# Altium schematic sheet EE464Project.SchDoc
size B; SheetNumber: 1; SheetTotal: 1
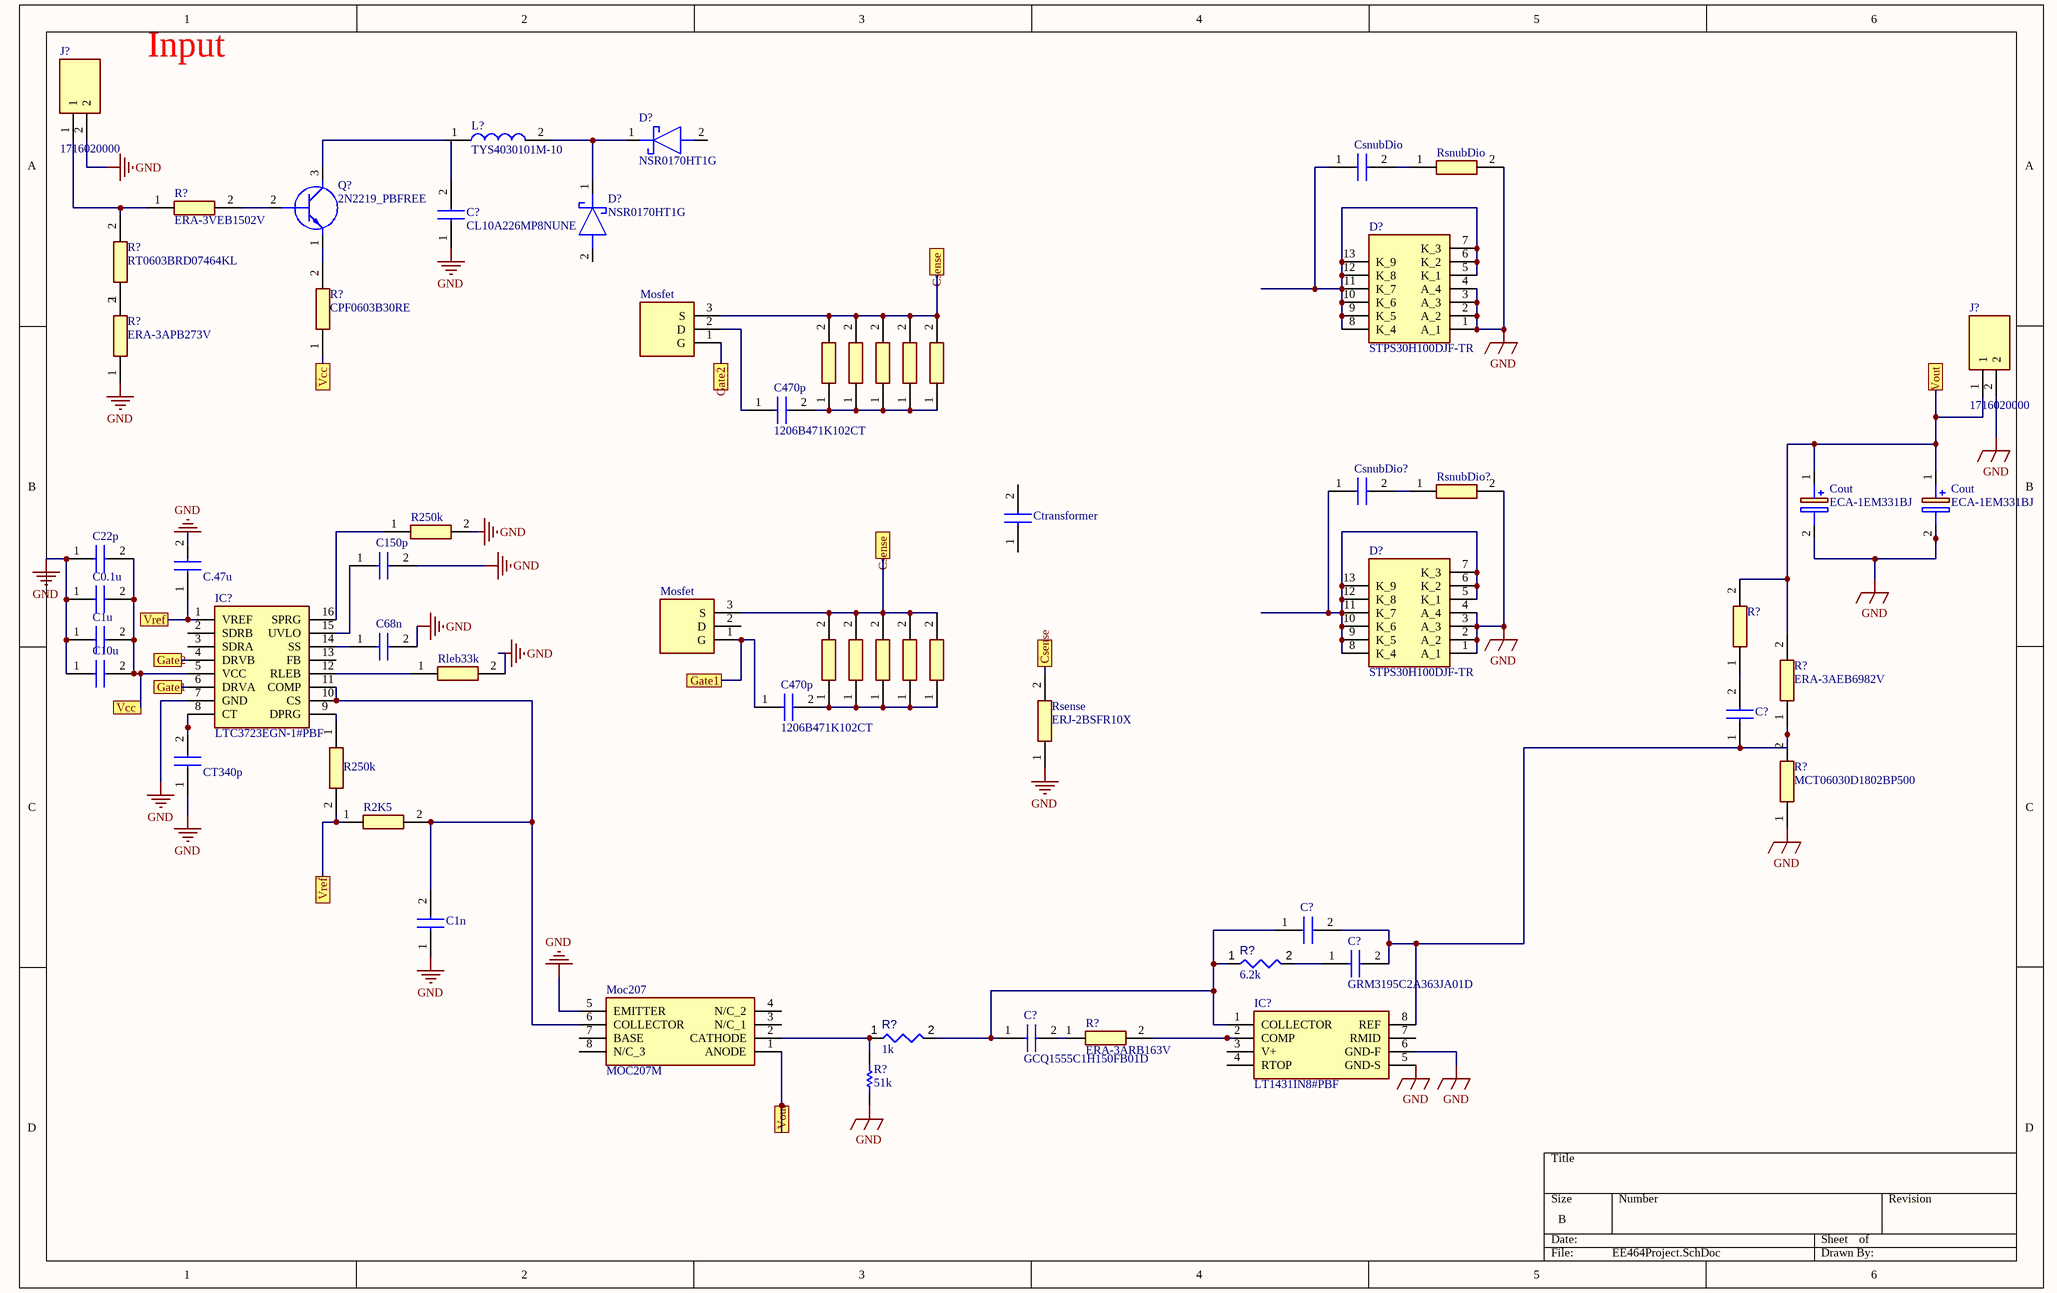
[diagram p0: EE464Project.SchDoc]

## Parts
(Parts that share a designator on the sheet are numbered #1, #2 ... from top to bottom, then left to right.)
C0.1u  06031C104K4Z2A  [CAPC1608X90N]  (value not drawn)
C1n  04025C102JAT2A  [CAPC1005X56N]  (value not drawn)
C1u  C1608X5R1H105K080AB  [CAPC1608X80N]  (value not drawn)
C10u  CL31A106MBHNNNE  [CAPC3216X180N]  (value not drawn)
C22p  06035A220JAT2A  [CAPC1608X90N]  (value not drawn)
C68n  885012206070  [CAPC1608X87N]  (value not drawn)
C150p  CL10C151JB8NNNC  [CAPC1608X90N]  (value not drawn)
C470p#1  1206B471K102CT  [CAPC3216X180N]
C470p#2  1206B471K102CT  [CAPC3216X180N]
C.47u  CGA4J1X8L1H474K125AE  [CAPC2012X145N]  (value not drawn)
C?#1  CL10A226MP8NUNE  [CAPC1608X105N]
C?#2  GRM21B5C2J222FWAAL  [CAPC2012X145N]  (value not drawn)
C?#3  C0402C121K8RACTU  [CAPC1005X55N]  (value not drawn)
C?#4  GRM3195C2A363JA01D  [CAPC3216X95N]
C?#5  GCQ1555C1H150FB01D  [CAPC1005X55N]
Cout#1  ECA-1EM331BJ  [CAPPRD350W65D825H1250]
Cout#2  ECA-1EM331BJ  [CAPPRD350W65D825H1250]
CsnubDio  GRM1885C2A201JA01D  [CAPC1608X90N]  (value not drawn)
CsnubDio?  GRM1885C2A201JA01D  [CAPC1608X90N]  (value not drawn)
CT340p  GRM1885C2A361JA01D  [CAPC1608X90N]  (value not drawn)
Ctransformer  C1210C104KBRACAUTO  [CAPC3225X280N]  (value not drawn)
D?#1  NSR0170HT1G  [SOD2512X100N]
D?#2  NSR0170HT1G  [SOD2512X100N]
D?#3  STPS30H100DJF-TR  [STPS30H100DJFTR]
D?#4  STPS30H100DJF-TR  [STPS30H100DJFTR]
IC?#1  LTC3723EGN-1#PBF  [SOP64P601X175-16N]
IC?#2  LT1431IN8#PBF  [DIP794W53P254L1016H394Q8N]
J?#1  1716020000  [1716020000]
J?#2  1716020000  [1716020000]
L?  TYS4030101M-10  [INDPM4040X300N]
Moc207  MOC207M  [SOIC127P594X363-8N]
Mosfet#1  STW11NK100Z  [TO545P515X1560X2445-3P]  (value not drawn)
Mosfet#2  STW11NK100Z  [TO545P515X1560X2445-3P]  (value not drawn)
Q?  2N2219_PBFREE  [2N3440PBFREE]
R2K5  ERA-3AED2491V  [ERA3AEB101V]  (value not drawn)
R250k#1  MCT06030C2493FP500  [RESC1608X55N]  (value not drawn)
R250k#2  MCT06030C2493FP500  [RESC1608X55N]  (value not drawn)
R?#1  ERA-3VEB1502V  [RESC1608X55N]
R?#2  RT0603BRD07464KL  [RESC1608X55N]
R?#3  CPF0603B30RE  [RESC1608X55N]
R?#4  ERA-3APB273V  [ERA3AEB101V]
R?#5  CPF0603B3K32E  [RESC1608X55N]  (value not drawn)
R?#6  ERA-3AEB6982V  [ERA3AEB101V]
R?#7  MCT06030D1802BP500  [RESC1608X55N]
R?#8  value 6.2k  [RESC0402(1005)_L]  (hidden comment: Resistor 6K2  +/-5 % 0402 63 mW)
R?#9  value 1k  [RESC0805(2012)_L]  (hidden comment: 1KR5J)
R?#10  ERA-3ARB163V  [ERA3AEB101V]
R?#11  value 51k  [RESC1005X40X25ML05T10]  (hidden comment: Resistor 51k +/-5% 0402 63 mW)
Rleb33k  ERA-3AED333V  [ERA3AEB101V]  (value not drawn)
Rsense  ERJ-2BSFR10X  [RESC1005X40N]
RsnubDio  RC0603FR-1022RL  [RESC1608X55N]  (value not drawn)
RsnubDio?  RC0603FR-1022RL  [RESC1608X55N]  (value not drawn)
Rsnubmos  CRGH2512F221R  [RESC6432X65N]  (value not drawn)
Rsnubmos?#1  CRGH2512F221R  [RESC6432X65N]  (value not drawn)
Rsnubmos?#2  CRGH2512F221R  [RESC6432X65N]  (value not drawn)
Rsnubmos?#3  CRGH2512F221R  [RESC6432X65N]  (value not drawn)
Rsnubmos?#4  CRGH2512F221R  [RESC6432X65N]  (value not drawn)
Rsnubmos?#5  CRGH2512F221R  [RESC6432X65N]  (value not drawn)
Rsnubmos?#6  CRGH2512F221R  [RESC6432X65N]  (value not drawn)
Rsnubmos?#7  CRGH2512F221R  [RESC6432X65N]  (value not drawn)
Rsnubmos?#8  CRGH2512F221R  [RESC6432X65N]  (value not drawn)
Rsnubmos?#9  CRGH2512F221R  [RESC6432X65N]  (value not drawn)

## Ports
Csense, Gate1, Gate2, Vcc, Vout, Vref

## Nets
GND: C0.1u.1 C1n.1 C1u.1 C10u.1 C22p.1 C68n.2 C150p.2 C.47u.2 C?#1.1 Cout#1.2(-) Cout#2.2(-) CT340p.1 D?#3.1(A_1) D?#3.2(A_2) D?#3.3(A_3) D?#3.4(A_4) D?#4.1(A_1) D?#4.2(A_2) D?#4.3(A_3) D?#4.4(A_4) IC?#1.7(GND) IC?#2.5(GND-S) IC?#2.6(GND-F) J?#1.2 J?#2.2 Moc207.5(EMITTER) R250k#1.2 R?#4.1 R?#7.1 R?#11.1 Rleb33k.2 Rsense.1 RsnubDio.2 RsnubDio?.2
Csense: Mosfet#1.3(S) Mosfet#2.3(S) Rsense.2 Rsnubmos.2 Rsnubmos?#1.2 Rsnubmos?#2.2 Rsnubmos?#3.2 Rsnubmos?#4.2 Rsnubmos?#5.2 Rsnubmos?#6.2 Rsnubmos?#7.2 Rsnubmos?#8.2 Rsnubmos?#9.2 ; port Csense
Gate1: C470p#2.1 IC?#1.6(DRVA) Mosfet#2.1(G) ; port Gate1
Gate2: IC?#1.4(DRVB) Mosfet#1.1(G) ; port Gate2
Vcc: C0.1u.2 C1u.2 C10u.2 C22p.2 IC?#1.5(VCC) R?#3.1 ; port Vcc
Vout: Cout#1.1(+) Cout#2.1(+) J?#2.1 Moc207.1(ANODE) R?#5.2 R?#6.2 ; port Vout
Vref: C.47u.1 IC?#1.1(VREF) R2K5.1 R250k#2.2 ; port Vref
NetC1n_2: C1n.2 IC?#1.10(CS) IC?#1.11(COMP) Moc207.6(COLLECTOR) R2K5.2
NetC68n_1: C68n.1 IC?#1.14(SS)
NetC150p_1: C150p.1 IC?#1.15(UVLO)
NetC470p#1_1: C470p#1.1 Mosfet#1.2(D)
NetC470p#1_2: C470p#1.2 Rsnubmos?#1.1 Rsnubmos?#2.1 Rsnubmos?#3.1 Rsnubmos?#4.1 Rsnubmos?#5.1
NetC470p#2_2: C470p#2.2 Rsnubmos.1 Rsnubmos?#6.1 Rsnubmos?#7.1 Rsnubmos?#8.1 Rsnubmos?#9.1
NetC?#2_1: C?#2.1 C?#3.2 C?#4.2 IC?#2.8(REF) R?#6.1 R?#7.2
NetC?#2_2: C?#2.2 R?#5.1
NetC?#3_1: C?#3.1 C?#5.1 IC?#2.1(COLLECTOR) R?#8.1 R?#9.2
NetC?#4_1: C?#4.1 R?#8.2
NetC?#5_2: C?#5.2 R?#10.1
NetCsnubDio?_1: CsnubDio?.1 D?#4.5(K_1) D?#4.6(K_2) D?#4.7(K_3) D?#4.8(K_4) D?#4.9(K_5) D?#4.10(K_6) D?#4.11(K_7) D?#4.12(K_8) D?#4.13(K_9)
NetCsnubDio?_2: CsnubDio?.2 RsnubDio?.1
NetCsnubDio_1: CsnubDio.1 D?#3.5(K_1) D?#3.6(K_2) D?#3.7(K_3) D?#3.8(K_4) D?#3.9(K_5) D?#3.10(K_6) D?#3.11(K_7) D?#3.12(K_8) D?#3.13(K_9)
NetCsnubDio_2: CsnubDio.2 RsnubDio.1
NetCT340p_2: CT340p.2 IC?#1.8(CT)
NetD?#1_1: D?#1.1(K) D?#2.1(K) L?.2
NetIC?#1_9: IC?#1.9(DPRG) R250k#2.1
NetIC?#1_12: IC?#1.12(RLEB) Rleb33k.1
NetIC?#1_16: IC?#1.16(SPRG) R250k#1.1
NetIC?#2_2: IC?#2.2(COMP) R?#10.2
NetJ?#1_1: J?#1.1 R?#1.1 R?#2.2
NetL?_1: L?.1 Q?.3(C)
NetMoc207_2: Moc207.2(CATHODE) R?#9.1 R?#11.2
NetQ?_1: Q?.1(E) R?#3.2
NetQ?_2: Q?.2(B) R?#1.2

Not connected (* = marked no-connect by the designer): C?#1 2; Ctransformer 1 2; D?#1 2(A); D?#2 2(A); IC?#1 2(SDRB) 3(SDRA) 13(FB); IC?#2 3(V+) 4(RTOP) 7(RMID); Moc207 3(N/C_1) 4(N/C_2) 7(BASE) 8(N/C_3); Mosfet#2 2(D); R?#2 1; R?#4 2

## Notes on the sheet
- Input

## Library data of the parts
C0.1u = 06031C104K4Z2A: Capacitor; Manufacturer_Name: AVX; Datasheet Link: https://componentsearchengine.com/Datasheets/1/06031A100FAT2A.pdf; Height: 0.9mm; Manufacturer_Part_Number: 06031C104K4Z2A; Mouser Part Number: 581-06031C104K4Z2A; Mouser Price/Stock: https://www.mouser.co.uk/ProductDetail/AVX/06031C104K4Z2A?qs=rI7uf1IzohSnOGTrilMFWw%3D%3D; Arrow Part Number: 06031C104K4Z2A; Arrow Price/Stock: https://www.arrow.com/en/products/06031c104k4z2a/avx
C1n = 04025C102JAT2A: Capacitor; Manufacturer_Name: AVX; Datasheet Link: http://www.mouser.com/catalog/supplier/library/pdf/AVXSurfaceMountCeramic.pdf; Height: 0.56mm; Manufacturer_Part_Number: 04025C102JAT2A; Mouser Part Number: 581-04025C102J; Mouser Price/Stock: https://www.mouser.co.uk/ProductDetail/AVX/04025C102JAT2A?qs=A%252BjgVRj0cIhSqwAr58%2FhLg%3D%3D; Arrow Part Number: 04025C102JAT2A; Arrow Price/Stock: https://www.arrow.com/en/products/04025c102jat2a/avx
C1u = C1608X5R1H105K080AB: Capacitor; Manufacturer_Name: TDK; Datasheet Link: https://product.tdk.com/info/en/catalog/datasheets/mlcc_commercial_midvoltage_en.pdf; Height: 0.8mm; Manufacturer_Part_Number: C1608X5R1H105K080AB; Mouser Part Number: 810-C1608X5R1H105K; Mouser Price/Stock: https://www.mouser.co.uk/ProductDetail/TDK/C1608X5R1H105K080AB?qs=NRhsANhppD%252BLmxnPDqAv3A%3D%3D; Arrow Part Number: C1608X5R1H105K080AB; Arrow Price/Stock: https://www.arrow.com/en/products/c1608x5r1h105k080ab/tdk
C10u = CL31A106MBHNNNE: Capacitor; Manufacturer_Name: Samsung Electro-Mechanics; Datasheet Link: https://media.digikey.com/pdf/Data%20Sheets/Samsung%20PDFs/CL_Series_MLCC_ds.pdf; Height: 1.8mm; Manufacturer_Part_Number: CL31A106MBHNNNE; Mouser Part Number: 187-CL31A106MBHNNNE; Mouser Price/Stock: https://www.mouser.co.uk/ProductDetail/Samsung-Electro-Mechanics/CL31A106MBHNNNE?qs=vLWxofP3U2ynwxdpGjlUyw%3D%3D; Arrow Part Number: CL31A106MBHNNNE; Arrow Price/Stock: https://www.arrow.com/en/products/cl31a106mbhnnne/samsung-electro-mechanics
C22p = 06035A220JAT2A: Capacitor; Manufacturer_Name: AVX; Datasheet Link: http://datasheets.avx.com/C0GNP0-Dielectric.pdf; Height: 0.9mm; Manufacturer_Part_Number: 06035A220JAT2A; Mouser Part Number: 581-06035A220J; Mouser Price/Stock: https://www.mouser.co.uk/ProductDetail/AVX/06035A220JAT2A?qs=WmCxkUxNecRe2%252BrYSa2zPg%3D%3D; Arrow Part Number: 06035A220JAT2A; Arrow Price/Stock: https://www.arrow.com/en/products/06035a220jat2a/avx
C68n = 885012206070: Capacitor; Manufacturer_Name: Wurth Elektronik; Datasheet Link: https://katalog.we-online.com/pbs/datasheet/885012206070.pdf; Height: 0.87mm; Manufacturer_Part_Number: 885012206070; Mouser Part Number: 710-885012206070; Mouser Price/Stock: https://www.mouser.co.uk/ProductDetail/Wurth-Elektronik/885012206070?qs=0KOYDY2FL2%252BdYxnLFqlX4w%3D%3D
C150p = CL10C151JB8NNNC: Capacitor; Manufacturer_Name: Samsung Electro-Mechanics; Datasheet Link: https://datasheet.datasheetarchive.com/originals/dk/DKDS-19/373912.pdf; Height: 0.9mm; Manufacturer_Part_Number: CL10C151JB8NNNC; Mouser Part Number: 187-CL10C151JB8NNNC; Mouser Price/Stock: https://www.mouser.co.uk/ProductDetail/Samsung-Electro-Mechanics/CL10C151JB8NNNC?qs=349EhDEZ59rP%2F9hZgT8P9g%3D%3D; Arrow Part Number: CL10C151JB8NNNC; Arrow Price/Stock: https://www.arrow.com/en/products/cl10c151jb8nnnc/samsung-electro-mechanics
C470p#1 C470p#2 = 1206B471K102CT: Capacitor; Manufacturer_Name: Walsin Technology Corporation; Datasheet Link: https://www.mouser.cn/datasheet/2/210/Middle_and_High_Voltage_DS-1535659.pdf; Height: 1.8mm; Manufacturer_Part_Number: 1206B471K102CT; Mouser Part Number: 791-1206B471K102CT; Mouser Price/Stock: https://www.mouser.com/Search/Refine.aspx?Keyword=791-1206B471K102CT
C.47u = CGA4J1X8L1H474K125AE: Capacitor; Manufacturer_Name: TDK; Datasheet Link: http://docs-europe.electrocomponents.com/webdocs/14e9/0900766b814e9125.pdf; Height: 1.45mm; Manufacturer_Part_Number: CGA4J1X8L1H474K125AE; Mouser Part Number: 810-CGA4J1X8L1H47412; Mouser Price/Stock: https://www.mouser.co.uk/ProductDetail/TDK/CGA4J1X8L1H474K125AE?qs=zW32dvEIR3uIPrP%252BfC4jsA%3D%3D
C?#1 = CL10A226MP8NUNE: Capacitor; Manufacturer_Name: Samsung Electro-Mechanics; Datasheet Link: http://www.samsungsem.com/global/front/downloadcms.do?path=%2F%2Fglobal%2F%2Fsupport%2F%2Fproduct-search%2F%2Fmlcc%2F%2F__icsFiles%2F%2Fafieldfile%2F%2F2017%2F%2F07%2F%2F28&fileName=S_CL10A226MP8NUNE.pdf; Height: 1.05mm; Manufacturer_Part_Number: CL10A226MP8NUNE; Mouser Part Number: 187-CL10A226MP8NUNE; Mouser Price/Stock: https://www.mouser.co.uk/ProductDetail/Samsung-Electro-Mechanics/CL10A226MP8NUNE?qs=gRKWieUq2Hb5O0PTfRKzDQ%3D%3D; Arrow Part Number: CL10A226MP8NUNE; Arrow Price/Stock: https://www.arrow.com/en/products/cl10a226mp8nune/samsung-electro-mechanics
C?#2 = GRM21B5C2J222FWAAL: Capacitor; Manufacturer_Name: Murata Electronics; Datasheet Link: http://www.murata.com/~/media/webrenewal/support/library/catalog/products/capacitor/mlcc/c02e.pdf; Height: 1.45mm; Manufacturer_Part_Number: GRM21B5C2J222FWAAL; Mouser Part Number: 81-GRM21B5C2J222FWAL; Mouser Price/Stock: https://www.mouser.co.uk/ProductDetail/Murata-Electronics/GRM21B5C2J222FWAAL?qs=hd1VzrDQEGgwnUkpelVx4g%3D%3D
C?#3 = C0402C121K8RACTU: Capacitor; Manufacturer_Name: Kemet; Datasheet Link: https://content.kemet.com/datasheets/KEM_C1002_X7R_SMD.pdf; Height: 0.55mm; Manufacturer_Part_Number: C0402C121K8RACTU; Mouser Part Number: 80-C0402C121K8RACTU; Mouser Price/Stock: https://www.mouser.co.uk/ProductDetail/KEMET/C0402C121K8RACTU/?qs=GedFDFLaBXGLzkg%252BSPpg%2FA%3D%3D
C?#4 = GRM3195C2A363JA01D: Capacitor; Manufacturer_Name: Murata Electronics; Datasheet Link: http://www.murata.com/~/media/webrenewal/support/library/catalog/products/capacitor/mlcc/c02e.pdf; Height: 0.95mm; Manufacturer_Part_Number: GRM3195C2A363JA01D; Mouser Part Number: 81-GRM3195C2A363JA1D; Mouser Price/Stock: https://www.mouser.co.uk/ProductDetail/Murata-Electronics/GRM3195C2A363JA01D?qs=qkDYIeTQ%252BEk8U7s55uioCQ%3D%3D
C?#5 = GCQ1555C1H150FB01D: Capacitor; Manufacturer_Name: Murata Electronics; Datasheet Link: https://componentsearchengine.com/Datasheets/1/GCQ1555C1H150FB01D.pdf; Height: 0.55mm; Manufacturer_Part_Number: GCQ1555C1H150FB01D; Mouser Part Number: 81-GCQ1555C1H150FB1D; Mouser Price/Stock: https://www.mouser.co.uk/ProductDetail/Murata-Electronics/GCQ1555C1H150FB01D?qs=0lQeLiL1qybEKEeEBMn8jw%3D%3D; Arrow Part Number: GCQ1555C1H150FB01D; Arrow Price/Stock: https://www.arrow.com/en/products/gcq1555c1h150fb01d/murata-manufacturing
Cout#1 Cout#2 = ECA-1EM331BJ: Capacitor Polarised; Manufacturer_Name: Panasonic; Datasheet Link: https://www.arrow.com/en/products/eca-1em331bj/panasonic; Height: 12.5mm; Manufacturer_Part_Number: ECA-1EM331BJ; Mouser Part Number: 667-ECA-1EM331BJ; Mouser Price/Stock: https://www.mouser.co.uk/ProductDetail/Panasonic/ECA-1EM331BJ/?qs=QmEuDp8986QdrzUPtmlFjw%3D%3D; Arrow Part Number: ECA-1EM331BJ; Arrow Price/Stock: https://www.arrow.com/en/products/eca-1em331bj/panasonic
CsnubDio CsnubDio? = GRM1885C2A201JA01D: Capacitor; Manufacturer_Name: Murata Electronics; Datasheet Link: http://www.murata.com/~/media/webrenewal/support/library/catalog/products/capacitor/mlcc/c02e.pdf; Height: 0.9mm; Manufacturer_Part_Number: GRM1885C2A201JA01D; Mouser Part Number: 81-GRM1885C2A201JA1D
CT340p = GRM1885C2A361JA01D: Capacitor; Manufacturer_Name: Murata Electronics; Height: 0.9mm; Manufacturer_Part_Number: GRM1885C2A361JA01D
Ctransformer = C1210C104KBRACAUTO: Capacitor; Manufacturer_Name: Kemet; Datasheet Link: https://componentsearchengine.com/Datasheets/2/C1210C104KBRACAUTO.pdf; Height: 2.8mm; Manufacturer_Part_Number: C1210C104KBRACAUTO; Mouser Part Number: 80-C1210C104KBRAUTO; Mouser Price/Stock: https://www.mouser.co.uk/ProductDetail/KEMET/C1210C104KBRACAUTO?qs=LTU7o1cE%2FK70wT3jsEJwBA%3D%3D
D?#1 D?#2 = NSR0170HT1G: Schottky Diode; Manufacturer_Name: ON Semiconductor; Datasheet Link: https://www.onsemi.com/pub/Collateral/NSR0170H-D.PDF; Height: 1mm; Manufacturer_Part_Number: NSR0170HT1G; Mouser Part Number: 863-NSR0170HT1G; Mouser Price/Stock: https://www.mouser.com/Search/Refine.aspx?Keyword=863-NSR0170HT1G; Arrow Part Number: NSR0170HT1G; Arrow Price/Stock: https://www.arrow.com/en/products/nsr0170ht1g/on-semiconductor
D?#3 D?#4 = STPS30H100DJF-TR: Schottky Diode; Manufacturer_Name: STMicroelectronics; Datasheet Link: https://www.st.com/resource/en/datasheet/stps30h100djf.pdf; Height: 1mm; Manufacturer_Part_Number: STPS30H100DJF-TR; Mouser Part Number: 511-STPS30H100DJF-TR; Mouser Price/Stock: https://www.mouser.co.uk/ProductDetail/STMicroelectronics/STPS30H100DJF-TR?qs=gNDSiZmRJS%252Bmsl1IUFl%2FqA%3D%3D; Arrow Part Number: STPS30H100DJF-TR; Arrow Price/Stock: https://www.arrow.com/en/products/stps30h100djf-tr/stmicroelectronics
IC?#1 = LTC3723EGN-1#PBF: Integrated Circuit; Manufacturer_Name: Linear Technology; Datasheet Link: http://www.linear.com/docs/1007; Height: 1.75mm; Manufacturer_Part_Number: LTC3723EGN-1#PBF; Mouser Part Number: 584-LTC3723EGN-1#PBF; Mouser Price/Stock: https://www.mouser.com/Search/Refine.aspx?Keyword=584-LTC3723EGN-1%23PBF
IC?#2 = LT1431IN8#PBF: Integrated Circuit; Manufacturer_Name: Linear Technology; Datasheet Link: https://www.analog.com/media/en/technical-documentation/data-sheets/1431fe.pdf; Height: 3.937mm; Manufacturer_Part_Number: LT1431IN8#PBF; Mouser Part Number: 584-LT1431IN8#PBF; Mouser Price/Stock: https://www.mouser.com/Search/Refine.aspx?Keyword=584-LT1431IN8%23PBF
J?#1 J?#2 = 1716020000: Connector; Manufacturer_Name: Weidmuller; Datasheet Link: https://catalog.weidmueller.com/catalog/Start.do?ObjectID=1716020000&_ga=2.21797499.1716783809.1613378202-511725545.1613378202; Manufacturer_Part_Number: 1716020000
L? = TYS4030101M-10: Inductor; Manufacturer_Name: Laird Performance Materials; Datasheet Link: https://componentsearchengine.com/Datasheets/1/TYS4030101M-10.pdf; Height: 3mm; Manufacturer_Part_Number: TYS4030101M-10; Mouser Part Number: 875-TYS4030101M-10; Mouser Price/Stock: https://www.mouser.com/Search/Refine.aspx?Keyword=875-TYS4030101M-10
Moc207 = MOC207M: Integrated Circuit; Manufacturer_Name: ON Semiconductor; Datasheet Link: https://www.onsemi.com/pub/Collateral/MOC217M-D.pdf; Height: 3.63mm; Manufacturer_Part_Number: MOC207M; Mouser Part Number: 512-MOC207M; Mouser Price/Stock: https://www.mouser.co.uk/ProductDetail/ON-Semiconductor-Fairchild/MOC207M?qs=NkuxCoaTQKYYnjhPw1nang%3D%3D; Arrow Part Number: MOC207M; Arrow Price/Stock: https://www.arrow.com/en/products/moc207m/on-semiconductor
Mosfet#1 Mosfet#2 = STW11NK100Z: Integrated Circuit; Manufacturer_Name: STMicroelectronics; Datasheet Link: http://www.st.com/web/en/resource/technical/document/datasheet/CD00003426.pdf; Height: 5.15mm; Manufacturer_Part_Number: STW11NK100Z; Mouser Part Number: 511-STW11NK100Z; Mouser Price/Stock: https://www.mouser.co.uk/ProductDetail/STMicroelectronics/STW11NK100Z?qs=wnz1wyZ0ZnXy8ArXh%2FwYmg%3D%3D; Arrow Part Number: STW11NK100Z; Arrow Price/Stock: https://www.arrow.com/en/products/stw11nk100z/stmicroelectronics
Q? = 2N2219_PBFREE: Transistor BJT NPN; Manufacturer_Name: Central Semiconductor; Manufacturer_Part_Number: 2N2219 PBFREE; Datasheet Link: https://my.centralsemi.com/get_document.php?cmp=1&mergetype=pd&mergepath=pd&pdf_id=2N2221A.PDF; Height: 6.6mm; Mouser Part Number: 610-2N2219-PB; Mouser Price/Stock: https://www.mouser.co.uk/ProductDetail/Central-Semiconductor/2N2219-PBFREE?qs=l7cgNqFNU1hh5MQQmrw1mA%3D%3D; Arrow Part Number: 2N2219 PBFREE; Arrow Price/Stock: https://www.arrow.com/en/products/2n2219-pbfree/central-semiconductor
R2K5 = ERA-3AED2491V: Resistor; Manufacturer_Name: Panasonic; Datasheet Link: https://industrial.panasonic.com/cdbs/www-data/pdf/RDM0000/AOA0000C307.pdf; Height: 0.55mm; Manufacturer_Part_Number: ERA-3AED2491V; Mouser Part Number: 667-ERA-3AED2491V; Mouser Price/Stock: https://www.mouser.co.uk/ProductDetail/Panasonic/ERA-3AED2491V?qs=MNPzkKEzRtTURs0mKAUGRQ%3D%3D
R250k#1 R250k#2 = MCT06030C2493FP500: Resistor; Manufacturer_Name: Vishay; Datasheet Link: http://www.vishay.com/docs/28705/mcx0x0xpro.pdf; Height: 0.55mm; Manufacturer_Part_Number: MCT06030C2493FP500; Mouser Part Number: 594-MCT06030C2493FP5; Mouser Price/Stock: https://www.mouser.com/Search/Refine.aspx?Keyword=594-MCT06030C2493FP5
R?#1 = ERA-3VEB1502V: Resistor; Manufacturer_Name: Panasonic; Datasheet Link: https://www.mouser.in/datasheet/2/315/Panasonic_Resistor_Thin_Film_(ERA-xV_2c_ERA-xK_Ser-1815278.pdf; Height: 0.55mm; Manufacturer_Part_Number: ERA-3VEB1502V; Mouser Part Number: 667-ERA-3VEB1502V; Mouser Price/Stock: https://www.mouser.co.uk/ProductDetail/Panasonic/ERA-3VEB1502V?qs=OlC7AqGiEDkoKxA%252BvKCzUw%3D%3D; Arrow Part Number: ERA-3VEB1502V; Arrow Price/Stock: https://www.arrow.com/en/products/era-3veb1502v/panasonic
R?#2 = RT0603BRD07464KL: Resistor; Manufacturer_Name: YAGEO (PHYCOMP); Datasheet Link: https://www.mouser.fr/datasheet/2/447/PYu-RT_1-to-0.01_RoHS_L_11-1669912.pdf; Height: 0.55mm; Manufacturer_Part_Number: RT0603BRD07464KL; Mouser Part Number: 603-RT0603BRD07464KL; Mouser Price/Stock: https://www.mouser.co.uk/ProductDetail/Yageo/RT0603BRD07464KL?qs=m9MW%2FJRFFS3yR3sDGxiA%2FQ%3D%3D
R?#3 = CPF0603B30RE: Resistor; Manufacturer_Name: TE Connectivity; Datasheet Link: http://www.farnell.com/datasheets/1786775.pdf; Height: 0.55mm; Manufacturer_Part_Number: CPF0603B30RE; Mouser Part Number: 279-CPF0603B30RE; Mouser Price/Stock: https://www.mouser.co.uk/ProductDetail/TE-Connectivity-Neohm/CPF0603B30RE?qs=gt1LBUVyoHlpGUuVLJ9HIg%3D%3D
R?#4 = ERA-3APB273V: Resistor; Manufacturer_Name: Panasonic; Datasheet Link: https://industrial.panasonic.com/cdbs/www-data/pdf/RDM0000/AOA0000C307.pdf; Height: 0.55mm; Manufacturer_Part_Number: ERA-3APB273V; Mouser Part Number: 667-ERA-3APB273V; Mouser Price/Stock: https://www.mouser.com/Search/Refine.aspx?Keyword=667-ERA-3APB273V
R?#5 = CPF0603B3K32E: Resistor; Manufacturer_Name: TE Connectivity; Datasheet Link: http://www.farnell.com/datasheets/1786775.pdf; Height: 0.55mm; Manufacturer_Part_Number: CPF0603B3K32E; Mouser Part Number: 279-CPF0603B3K32E; Mouser Price/Stock: https://www.mouser.co.uk/ProductDetail/TE-Connectivity-Neohm/CPF0603B3K32E?qs=s1WWODT2SXU5S6IP14mfOA%3D%3D
R?#6 = ERA-3AEB6982V: Resistor; Manufacturer_Name: Panasonic; Datasheet Link: https://industrial.panasonic.com/cdbs/www-data/pdf/RDM0000/AOA0000C307.pdf; Height: 0.55mm; Manufacturer_Part_Number: ERA-3AEB6982V; Mouser Part Number: 667-ERA-3AEB6982V; Mouser Price/Stock: https://www.mouser.co.uk/ProductDetail/Panasonic/ERA-3AEB6982V?qs=nuXzIS8loXG44F6SvdF0rQ%3D%3D
R?#7 = MCT06030D1802BP500: Resistor; Manufacturer_Name: Vishay; Datasheet Link: http://www.vishay.com/docs/28705/mcx0x0xpro.pdf; Height: 0.55mm; Manufacturer_Part_Number: MCT06030D1802BP500; Mouser Part Number: 594-MCT06030D1802BP5; Mouser Price/Stock: https://www.mouser.com/Search/Refine.aspx?Keyword=594-MCT06030D1802BP5
R?#8 = CMP-009-00147-3: Chip Resistor, 6,2 kOhms, +/-5 %, 63 mW, -55 to 155 degC, 0402; Tolerance: 5%; Power: 63mW; Min Operating Temperature: -55°C; Pins: 2; Max Operating Temperature: 155°C; Case/Package: 0402
R?#9 = CMP-009-00076-2: 1K 0.125W 5% 0805 (2012 Metric)  SMD; Power: 125mW; Pins: 2; Mounting Technology: SMT; Tolerance: 5%; Case/Package: 0805
R?#10 = ERA-3ARB163V: Resistor; Manufacturer_Name: Panasonic; Datasheet Link: https://industrial.panasonic.com/cdbs/www-data/pdf/RDM0000/AOA0000C307.pdf; Height: 0.55mm; Manufacturer_Part_Number: ERA-3ARB163V; Mouser Part Number: 667-ERA-3ARB163V; Mouser Price/Stock: https://www.mouser.co.uk/ProductDetail/Panasonic/ERA-3ARB163V/?qs=ob%252BdNz2%252BYEgOuIDPhzMhhA%3D%3D
R?#11 = CMP-009-00000-5: Chip Resistor, 51 KOhm, +/- 5%, 0.063 W, -55 to 155 degC, 0402 (1005 Metric); Power: 63mW; Case/Package: 0402; Min Operating Temperature: -55°C; Mounting Technology: SM; RoHS Compliant: True; Max Operating Temperature: 155°C; Tolerance: 5%; Pins: 2
Rleb33k = ERA-3AED333V: Resistor; Manufacturer_Name: Panasonic; Datasheet Link: https://industrial.panasonic.com/cdbs/www-data/pdf/RDM0000/AOA0000C307.pdf; Height: 0.55mm; Manufacturer_Part_Number: ERA-3AED333V; Mouser Part Number: 667-ERA-3AED333V; Mouser Price/Stock: https://www.mouser.co.uk/ProductDetail/Panasonic/ERA-3AED333V?qs=yocZuyCaXdPx5xHP%2FbupFw%3D%3D
Rsense = ERJ-2BSFR10X: Resistor; Manufacturer_Name: Panasonic; Datasheet Link: https://industrial.panasonic.com/cdbs/www-data/pdf/RDN0000/AOA0000C313.pdf; Height: 0.4mm; Manufacturer_Part_Number: ERJ-2BSFR10X; Mouser Part Number: 667-ERJ-2BSFR10X; Mouser Price/Stock: https://www.mouser.co.uk/ProductDetail/Panasonic/ERJ-2BSFR10X?qs=0n%252BW%2FEG%252BKm7ed6yiU%2FeiUw%3D%3D; Arrow Part Number: ERJ-2BSFR10X; Arrow Price/Stock: https://www.arrow.com/en/products/erj-2bsfr10x/panasonic
RsnubDio RsnubDio? = RC0603FR-1022RL: Resistor; Manufacturer_Name: YAGEO (PHYCOMP); Datasheet Link: http://www.yageo.com/documents/recent/PYu-RC0603_51_RoHS_L_v5.pdf; Height: 0.55mm; Manufacturer_Part_Number: RC0603FR-1022RL; Mouser Part Number: 603-RC0603FR-1022RL; Mouser Price/Stock: https://www.mouser.com/Search/Refine.aspx?Keyword=603-RC0603FR-1022RL
Rsnubmos Rsnubmos?#1-Rsnubmos?#9 = CRGH2512F221R: Resistor; Manufacturer_Name: TE Connectivity; Datasheet Link: http://docs-europe.electrocomponents.com/webdocs/12d7/0900766b812d7379.pdf; Height: 0.65mm; Manufacturer_Part_Number: CRGH2512F221R; Mouser Part Number: 279-CRGH2512F221R; Mouser Price/Stock: https://www.mouser.com/Search/Refine.aspx?Keyword=279-CRGH2512F221R